# Altium project Test-Jig.PrjPcb
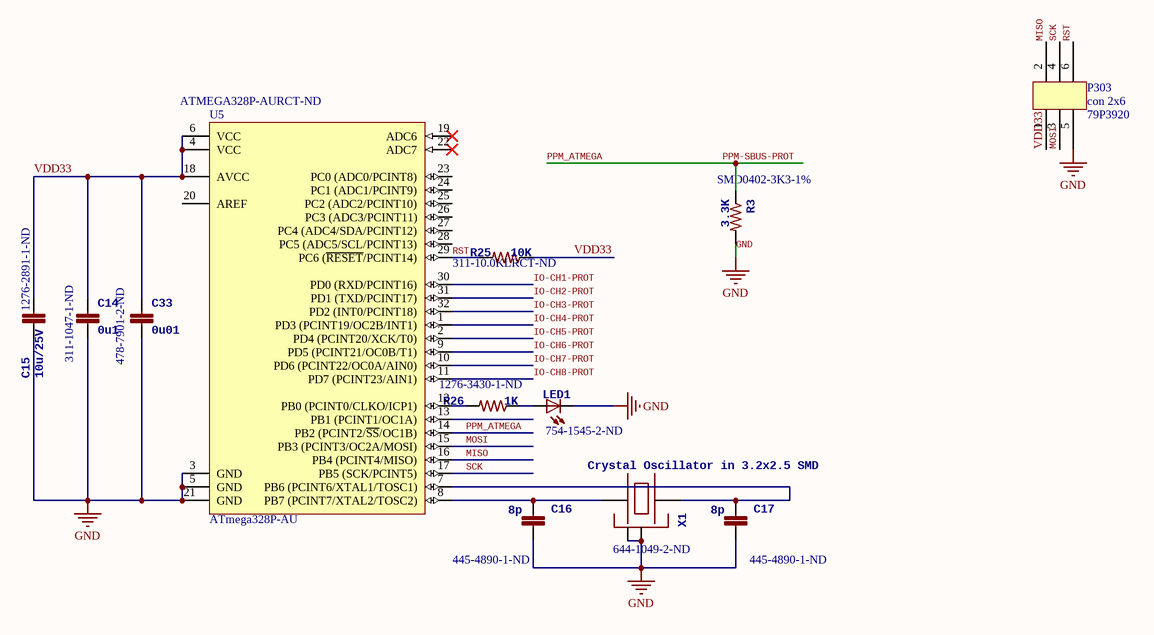
[diagram p0: Test_Jig_PPM-Encoder.SchDoc]
5 sheets, 143 parts. Net scope: global (net labels, ports and power ports of the same name join across sheets).
Board file: Test_Jig.PcbDoc
Sheets:
  Test_Jig_PPM-Encoder.SchDoc
  Test_Jig_BMP2.SchDoc
  Test_Jig_Pixhawk_DUT.SchDoc
  Test_Jig_USB.SchDoc
  Test_Jig_BMP1.SchDoc

## Sheet Test_Jig_PPM-Encoder.SchDoc
size A2; DrawnBy: Philip Rowse

### Parts
C14  0u1  Supplier Part Number 1: 311-1047-1-ND  [0402-CAP]
C15  10u/25V  Supplier Part Number 1: 1276-2891-1-ND  [0805-CAP]
C16  8p  Supplier Part Number 1: 445-4890-1-ND  [0402-CAP]
C17  8p  Supplier Part Number 1: 445-4890-1-ND  [0402-CAP]
C33  0u01  Supplier Part Number 1: 478-7901-2-ND  [0603-CAP]
LED1  Supplier Part Number 1: 754-1545-2-ND  [0603-LED-Blue]  (hidden comment: LED0603_Green)
P303  con 2x6  Supplier Part Number 1: 79P3920  [TSW-103-07-G-D]
R3  3.3K  Supplier Part Number 1: SMD0402-3K3-1%  [C0402]
R25  10K  Supplier Part Number 1: 311-10.0KLRCT-ND  [0402-RES]
R26  1K  Supplier Part Number 1: 1276-3430-1-ND  [0402-RES]
U5  ATmega328P-AU  Supplier Part Number 1: ATMEGA328P-AURCT-ND  [32A_N]
X1  Crystal Oscillator in 3.2x2.5 SMD  Supplier Part Number 1: 644-1049-2-ND  [OSCILLATOR-3.2X2.5]

### Nets
GND: C14.P$2 C15.P$2 C16.P$1 C17.P$1 C33.P$2 LED1.C P303.5 R3.2 U5.3(GND) U5.5(GND) U5.21(GND) X1.2(NC_2) X1.4(NC_4)
IO-CH1-PROT: U5.30(PD0_(RXD/PCINT16))
IO-CH2-PROT: U5.31(PD1_(TXD/PCINT17))
IO-CH3-PROT: U5.32(PD2_(INT0/PCINT18))
IO-CH4-PROT: U5.1(PD3_(PCINT19/OC2B/INT1))
IO-CH5-PROT: U5.2(PD4_(PCINT20/XCK/T0))
IO-CH6-PROT: U5.9(PD5_(PCINT21/OC0B/T1))
IO-CH7-PROT: U5.10(PD6_(PCINT22/OC0A/AIN0))
IO-CH8-PROT: U5.11(PD7_(PCINT23/AIN1))
MISO: P303.2 U5.16(PB4_(PCINT4/MISO))
MOSI: P303.3 U5.15(PB3_(PCINT3/OC2A/MOSI))
PPM-SBUS-PROT: R3.1 U5.14(PB2_(PCINT2/~{SS}/OC1B))  [also labelled PPM_ATMEGA]
RST: P303.6 R25.P$2 U5.29(PC6_(~{RESET}/PCINT14))
SCK: P303.4 U5.17(PB5_(SCK/PCINT5))
VDD33: C14.P$1 C15.P$1 C33.P$1 P303.1 R25.P$1 U5.4(VCC) U5.6(VCC) U5.18(AVCC)
NetC16_P$2: C16.P$2 U5.8(PB7_(PCINT7/XTAL2/TOSC2)) X1.1
NetC17_P$2: C17.P$2 U5.7(PB6_(PCINT6/XTAL1/TOSC1)) X1.3
NetLED1_A: LED1.A R26.P$1
NetR26_P$2: R26.P$2 U5.12(PB0_(PCINT0/CLKO/ICP1))

Not connected (* = marked no-connect by the designer): U5 13(PB1_(PCINT1/OC1A)) 19(ADC6)* 20(AREF) 22(ADC7)* 23(PC0_(ADC0/PCINT8)) 24(PC1_(ADC1/PCINT9)) 25(PC2_(ADC2/PCINT10)) 26(PC3_(ADC3/PCINT11)) 27(PC4_(ADC4/SDA/PCINT12)) 28(PC5_(ADC5/SCL/PCINT13))

### Notes on the sheet
- Title
- Size:
- Date:
- File:
- A2
- Number:
- Time:
- Revision:
- Sheet
- of

### Library data of the parts
C14 = CAP0402: CAP CER 0.1UF 16V Y5V 0402; PARTNO: CC0402ZRY5V7BB104; 3DR_PARTNO: ECM0700; Supplier 1: Digi-Key; Value: 0u1
C15 = CAP0805: CAP CER 10UF 25V 10% X5R 0805; PARTNO: CL21A106KAYNNNE; 3DR_PARTNO: ECM0714; Value: 10u/25; Supplier 1: Digi-Key
C16 C17 = CAP0402: CAP CER 8PF 50V C0G 0402; PARTNO: C1005C0G1H080C; 3DR_PARTNO: ECM0710; Supplier 1: Digi-Key; Value: 8p
C33 = CAP0603: CAP CER 10000PF 25V 5% X7R 0603; PARTNO: 06033C103JAT2A; 3DR_PARTNO: ECM0620; Supplier 1: Digi-Key; Value: 0u01
LED1 = LED0603_Blue: LED GREEN ROUND CLEAR SMD; 3DR_PARTNO: ECM0494; PARTNO: APTD1608CGCK; Supplier 1: Digi-Key; Value: GREEN
P303 = con 2x6: Connector, Header, 6Pos, 2.54MM, Vert, THT, Au; 3DR_PARTNO: PRT0445; Supplier 1: Newark
R3 = RESISTOR0402: Supplier 1: TME
R25 = RESISTOR0402-RES: RES 10K OHM 1/16W 1% 0402 SMD; PARTNO: RC0402FR-0710KL; 3DR_PARTNO: ECM0800; Supplier 1: Digi-Key; Value: 10K
R26 = RESISTOR0402-RES: RES 1K OHM 1/16W 1% 0402; PARTNO: RC1005F102CS; 3DR_PARTNO: ECM0804; Supplier 1: Digi-Key; Value: 1K
U5 = ATmega328P-AU: 8-bit AVR Microcontroller, 32KB Flash, 1KB EEPROM, 2KB SRAM, 32-pin TQFP, Industrial Grade (-40°C to 85°C); DatasheetVersion: revD, May-2011; PackageVersion: revC, Oct-2010; PackageReference: 32A; PackageDescription: 32-Lead, 7x7x1.0 mm Body, 0.8mm Lead Pitch, Thin Profile Plastic Quad Flat Package (TQFP); Code_JEDEC: MS-026-ABA; ComponentLink1Description: Manufacturer URL; ComponentLink1URL: http://www.atmel.com/; ComponentLink2Description: ATmega48A/48PA/88A/88PA/168A/168PA/328/328P Datasheet; ComponentLink2URL: http://www.atmel.com/dyn/resources/prod_documents/doc8271.pdf; ComponentLink3Description: ATmega48A/48PA/88A/88PA/168A/168PA/328/328P Summary; ComponentLink3URL: http://www.atmel.com/dyn/resources/prod_documents/8271S.pdf; Supplier 1: Digi-Key
X1 = OSCILLATOR-3.2X2.5: CRYSTAL 16MHZ 8PF SMD; PARTNO: NX3225SA-16.000MHZ-STD-CSR-1; Supplier 1: Digi-Key; Value: 16MHz

## Sheet Test_Jig_BMP2.SchDoc
size A4; DrawnBy: Philip Rowse; CHECK: SAM K; CHECK_DATE: 1/2015; DOC_TITLE_1: MAGIA NEGRA PROBE V2.0; ENGR: JEFF W; ENG_DATE: 1/2015; MFG: JUAN V; MFG_DATE: 1/2015; QA: ALLAN G; QA_DATE: 1/2015; REV: X1; YEAR: 2015
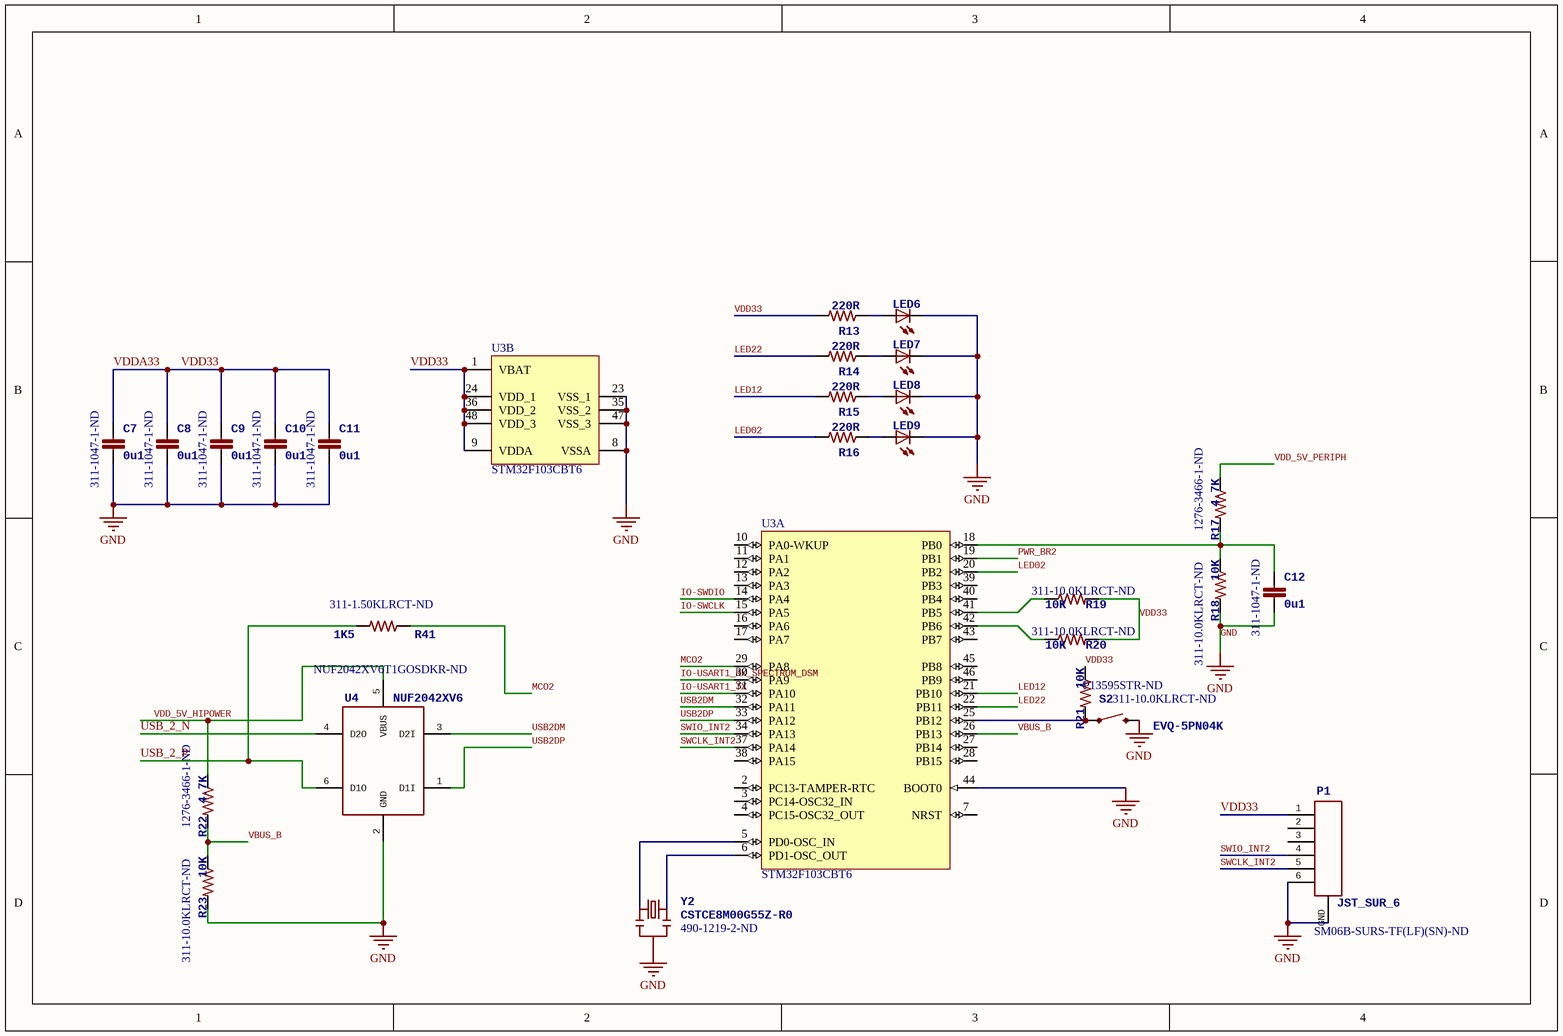
[diagram p1: Test_Jig_BMP2.SchDoc]

### Parts
C7  0u1  Supplier Part Number 1: 311-1047-1-ND  [0402-CAP]
C8  0u1  Supplier Part Number 1: 311-1047-1-ND  [0402-CAP]
C9  0u1  Supplier Part Number 1: 311-1047-1-ND  [0402-CAP]
C10  0u1  Supplier Part Number 1: 311-1047-1-ND  [0402-CAP]
C11  0u1  Supplier Part Number 1: 311-1047-1-ND  [0402-CAP]
C12  0u1  Supplier Part Number 1: 311-1047-1-ND  [0402-CAP]
LED6  LED0603_Green  [0603-LED-Blue]  (value not drawn)
LED7  LED0603_Green  [0603-LED-Blue]  (value not drawn)
LED8  LED0603_Green  [0603-LED-Blue]  (value not drawn)
LED9  LED0603_Green  [0603-LED-Blue]  (value not drawn)
P1  JST_SUR_6  Supplier Part Number 1: SM06B-SURS-TF(LF)(SN)-ND  [JST_SUR_H6]
R13  220R  [0402-RES]
R14  220R  [0402-RES]
R15  220R  [0402-RES]
R16  220R  [0402-RES]
R17  4.7K  Supplier Part Number 1: 1276-3466-1-ND  [0402-RES]
R18  10K  Supplier Part Number 1: 311-10.0KLRCT-ND  [0402-RES]
R19  10K  Supplier Part Number 1: 311-10.0KLRCT-ND  [0402-RES]
R20  10K  Supplier Part Number 1: 311-10.0KLRCT-ND  [0402-RES]
R21  10K  Supplier Part Number 1: 311-10.0KLRCT-ND  [0402-RES]
R22  4.7K  Supplier Part Number 1: 1276-3466-1-ND  [0402-RES]
R23  10K  Supplier Part Number 1: 311-10.0KLRCT-ND  [0402-RES]
R41  1K5  Supplier Part Number 1: 311-1.50KLRCT-ND  [0402-RES]
S2  EVQ-5PN04K  Supplier Part Number 1: P13595STR-ND  [TACTILE-SWITCH-1101NE]
U3  STM32F103CBT6  [STM-LQFP48_N]  (parts A,B of 2)
U4  NUF2042XV6  Supplier Part Number 1: NUF2042XV6T1GOSDKR-ND  [SOT563-6]
Y2  CSTCE8M00G55Z-R0  Supplier Part Number 1: 490-1219-2-ND  [RESONATOR-SMD]

### Nets
GND: C7.P$2 C8.P$2 C9.P$2 C10.P$2 C11.P$2 C12.P$2 LED6.C LED7.C LED8.C LED9.C P1.6 P1.GND R18.P$2 R23.P$2 S2.2 U3.8(VSSA) U3.23(VSS_1) U3.35(VSS_2) U3.44(BOOT0) U3.47(VSS_3) U4.2(GND) Y2.2
IO-SWCLK: U3.15(PA5)
IO-SWDIO: U3.14(PA4)
IO-USART1_RX_SPECTRUM_DSM: U3.30(PA9)
IO-USART1_TX: U3.31(PA10)
LED02: R16.P$2 U3.20(PB2)
LED12: R15.P$2 U3.21(PB10)
LED22: R14.P$2 U3.22(PB11)
MCO2: R41.P$1 U3.29(PA8)
PWR_BR2: U3.19(PB1)
SWCLK_INT2: P1.5 U3.37(PA14)
SWIO_INT2: P1.4 U3.34(PA13)
USB2DM: U3.32(PA11) U4.3(D2I)
USB2DP: U3.33(PA12) U4.1(D1I)
USB_2_N: U4.4(D2O)
USB_2_P: R41.P$2 U4.6(D1O)
VBUS_B: R22.P$2 R23.P$1 U3.26(PB13)
VDD33: C7.P$1 C8.P$1 C9.P$1 C10.P$1 C11.P$1 P1.1 R13.P$2 R19.P$2 R20.P$2 R21.P$1 U3.1(VBAT) U3.9(VDDA) U3.24(VDD_1) U3.36(VDD_2) U3.48(VDD_3)  [also labelled VDDA33]
VDD_5V_HIPOWER: R22.P$1 U4.5(VBUS)
VDD_5V_PERIPH: R17.P$1
NetC12_P$1: C12.P$1 R17.P$2 R18.P$1 U3.18(PB0)
NetLED6_A: LED6.A R13.P$1
NetLED7_A: LED7.A R14.P$1
NetLED8_A: LED8.A R15.P$1
NetLED9_A: LED9.A R16.P$1
NetR19_P$1: R19.P$1 U3.41(PB5)
NetR20_P$1: R20.P$1 U3.42(PB6)
NetR21_P$2: R21.P$2 S2.1 U3.25(PB12)
NetU3_5: U3.5(PD0-OSC_IN) Y2.1
NetU3_6: U3.6(PD1-OSC_OUT) Y2.3

Not connected (* = marked no-connect by the designer): P1 2 3; U3 2(PC13-TAMPER-RTC) 3(PC14-OSC32_IN) 4(PC15-OSC32_OUT) 7(NRST) 10(PA0-WKUP) 11(PA1) 12(PA2) 13(PA3) 16(PA6) 17(PA7) 27(PB14) 28(PB15) 38(PA15) 39(PB3) 40(PB4) 43(PB7) 45(PB8) 46(PB9)

### Library data of the parts
C7-C12 = CAP0402: as C14 on sheet Test_Jig_PPM-Encoder; Supplier 1: Digi-Key; Value: 0u1
LED6-LED9 = LED0603_Blue: as LED1 on sheet Test_Jig_PPM-Encoder; Supplier 1: Digi-Key; Supplier Part Number 1: 754-1545-2-ND; Value: GREEN
P1 = JST_SUR_6: Connector, Header, 6Pos, .8mm IDC, R/A, SMD, Tin; 3DR_PARTNO: PRT0442; Supplier 1: Digi-Key
R13-R16 = RESISTOR0402-RES: RES 220 OHM 1/16W 1% 0402 SMD; PARTNO: RC0402FR-07220RL; 3DR_PARTNO: ECM0821; Supplier 1: Digi-Key; Supplier Part Number 1: 311-220LRCT-ND; Value: 220R
R17 R22 = RESISTOR0402-RES: RES 10K OHM 1/16W 1% 0402 SMD; PARTNO: RC1005F472CS; Value: 10K; Supplier 1: Digi-Key
R18-R21 R23 = RESISTOR0402-RES: as R25 on sheet Test_Jig_PPM-Encoder; Supplier 1: Digi-Key; Value: 10K
R41 = RESISTOR0402-RES: RES 1.5K OHM 1/16W 1% 0402 SMD; PARTNO: RC0402FR-071K5L; 3DR_PARTNO: ECM0803; Supplier 1: Digi-Key; Value: 1K5
S2 = SWITCH-MOMENTARY-2-SMD-1101NE: Supplier 1: Digi-Key
U3 = STM32F103CBT6: ARM Cortex-M3 32-bit MCU, 128 KB Flash, 20 KB Internal RAM, 37 I/Os, 48-pin LQFP, -40 to 85 degC, Tray; A/D Converter: 2x12-bit (10 Channel); FLASH Size (Prog) (kB): 128; I/Os (High Current): 37; Internal RAM Size (kB): 20; Operating Frequency(F) (Processor speed) (MHz): 72; Supply Voltage(Vcc) min (V): 2; DatasheetVersion: Rev. 16; PackageVersion: Rev. 6, 06/2013; PackageReference: LQFP48; PackageDescription: 48-Pin Low Profile Quad Flat Package, 7 x 7 mm Body, 0.5 mm Pitch; Supplier 1: Digi-Key; Supplier Part Number 1: 497-6288-ND; Supplier 2: Farnell; Supplier Part Number 2: 1606327; Supplier 3: Newark; Supplier Part Number 3: 11N8296; Supplier 4: Newark; Supplier Part Number 4: 57P1214; Supplier 5: Mouser; Supplier Part Number 5: 511-STM32F103CBT6; Core: ARM Cortex-M3; Packing: Tray; Mounting Technology: Surface Mount; PartNumber: STM32F103CBT6; ComponentLink1Description: Manufacturer URL; ComponentLink1URL: http://www.st.com/web/en/home.html; ComponentLink2Description: Datasheet; ComponentLink2URL: http://www.st.com/st-web-ui/static/active/en/resource/technical/document/datasheet/CD00161566.pdf; ComponentLink3Description: Package Specification; ComponentLink3URL: http://www.st.com/st-web-ui/static/active/en/resource/technical/document/datasheet/DM00058181.pdf
U4 = NUF2042XV6: IC FILTER USB ESD PROTECT SOT363; PARTNO: NUF2042XV6T1G; 3DR_PARTNO: ECM0836; Supplier 1: Digi-Key
Y2 = RESONATORSMD: Supplier 1: Digi-Key

## Sheet Test_Jig_Pixhawk_DUT.SchDoc
size A2; DrawnBy: Philip Rowse
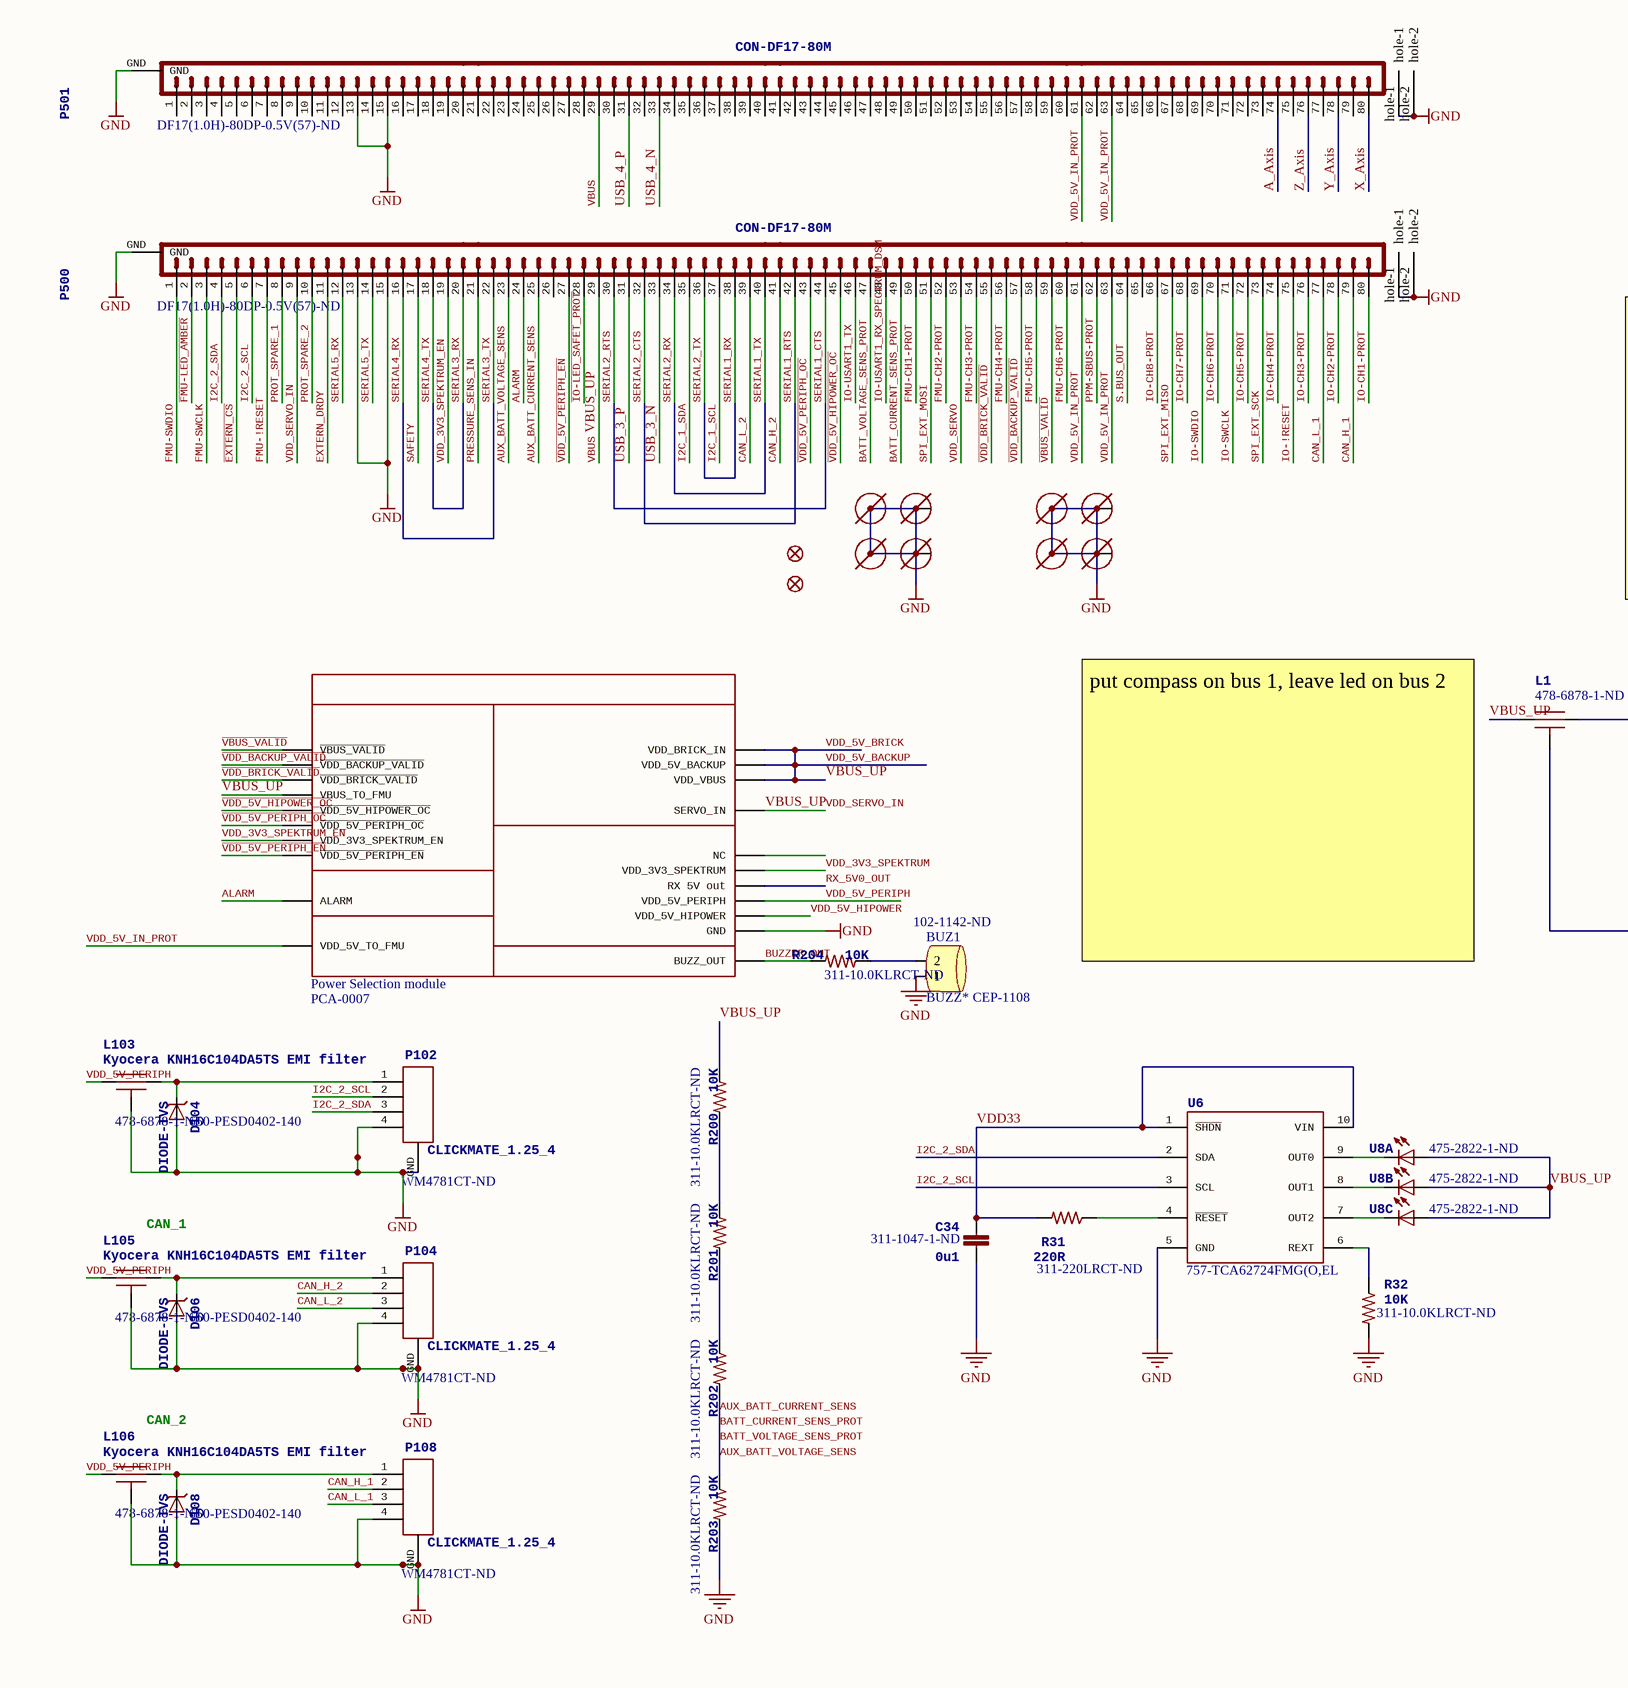
[diagram p2: Test_Jig_Pixhawk_DUT.SchDoc, left]
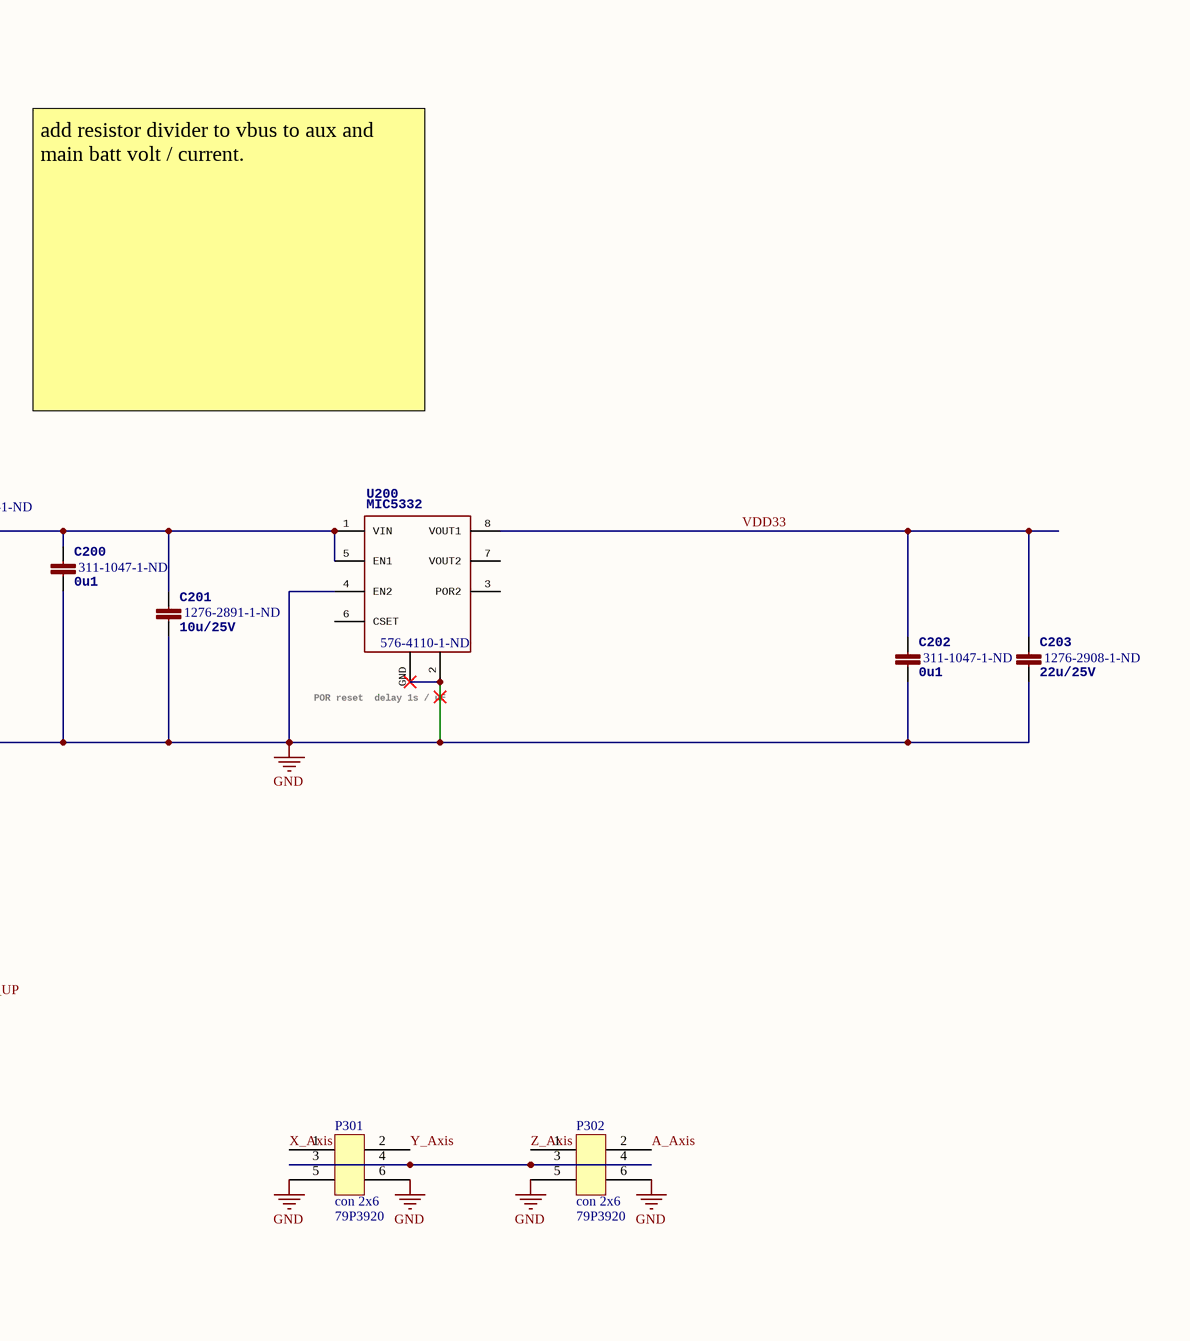
[diagram p3: Test_Jig_Pixhawk_DUT.SchDoc, right]

### Parts
BUZ1  BUZZ* CEP-1108  Supplier Part Number 1: 102-1142-ND  [CEP-1108]
C34  0u1  Supplier Part Number 1: 311-1047-1-ND  [0402-CAP]
C200  0u1  Supplier Part Number 1: 311-1047-1-ND  [0402-CAP]
C201  10u/25V  Supplier Part Number 1: 1276-2891-1-ND  [0805-CAP]
C202  0u1  Supplier Part Number 1: 311-1047-1-ND  [0402-CAP]
C203  22u/25V  Supplier Part Number 1: 1276-2908-1-ND  [0805-CAP]
D104  DIODE-TVS  Supplier Part Number 1: 650-PESD0402-140  [0402-TVS]
D106  DIODE-TVS  Supplier Part Number 1: 650-PESD0402-140  [0402-TVS]
D108  DIODE-TVS  Supplier Part Number 1: 650-PESD0402-140  [0402-TVS]
JP400  FIDUCIAL1.5X3  [FIDUCIAL-1.5X3]  (value not drawn)
JP401  FIDUCIAL1.5X3  [FIDUCIAL-1.5X3]  (value not drawn)
L1  Supplier Part Number 1: 478-6878-1-ND  [KYOCERA-KNH16-DA]  (hidden comment: Kyocera KNH16C104DA5TS EMI filter)
L103  Kyocera KNH16C104DA5TS EMI filter  Supplier Part Number 1: 478-6878-1-ND  [KYOCERA-KNH16-DA]
L105  Kyocera KNH16C104DA5TS EMI filter  Supplier Part Number 1: 478-6878-1-ND  [KYOCERA-KNH16-DA]
L106  Kyocera KNH16C104DA5TS EMI filter  Supplier Part Number 1: 478-6878-1-ND  [KYOCERA-KNH16-DA]
M3_MOUNT901  MOUNT-HOLE1.8MM  [MOUNT-HOLE1.8]  (value not drawn)
M3_MOUNT902  MOUNT-HOLE1.8MM  [MOUNT-HOLE1.8]  (value not drawn)
M3_MOUNT903  MOUNT-HOLE1.8MM  [MOUNT-HOLE1.8]  (value not drawn)
M3_MOUNT904  MOUNT-HOLE1.8MM  [MOUNT-HOLE1.8]  (value not drawn)
M3_MOUNT911  MOUNT-HOLE1.8MM  [MOUNT-HOLE1.8]  (value not drawn)
M3_MOUNT912  MOUNT-HOLE1.8MM  [MOUNT-HOLE1.8]  (value not drawn)
M3_MOUNT913  MOUNT-HOLE1.8MM  [MOUNT-HOLE1.8]  (value not drawn)
M3_MOUNT914  MOUNT-HOLE1.8MM  [MOUNT-HOLE1.8]  (value not drawn)
P102  CLICKMATE_1.25_4  Supplier Part Number 1: WM4781CT-ND  [CLICKMATE_V4]
P104  CLICKMATE_1.25_4  Supplier Part Number 1: WM4781CT-ND  [CLICKMATE_V4]
P108  CLICKMATE_1.25_4  Supplier Part Number 1: WM4781CT-ND  [CLICKMATE_V4]
P301  con 2x6  Supplier Part Number 1: 79P3920  [TSW-103-07-G-D]
P302  con 2x6  Supplier Part Number 1: 79P3920  [TSW-103-07-G-D]
P500  CON-DF17-80M  Supplier Part Number 1: DF17(1.0H)-80DP-0.5V(57)-ND  [CON-DF17-80M]
P501  CON-DF17-80M  Supplier Part Number 1: DF17(1.0H)-80DP-0.5V(57)-ND  [CON-DF17-80M]
PSM200  Power Selection module  Supplier Part Number 1: PCA-0007  [PSM]
R31  220R  Supplier Part Number 1: 311-220LRCT-ND  [0402-RES]
R32  10K  Supplier Part Number 1: 311-10.0KLRCT-ND  [0402-RES]
R200  10K  Supplier Part Number 1: 311-10.0KLRCT-ND  [0402-RES]
R201  10K  Supplier Part Number 1: 311-10.0KLRCT-ND  [0402-RES]
R202  10K  Supplier Part Number 1: 311-10.0KLRCT-ND  [0402-RES]
R203  10K  Supplier Part Number 1: 311-10.0KLRCT-ND  [0402-RES]
R204  10K  Supplier Part Number 1: 311-10.0KLRCT-ND  [0402-RES]
U6  Supplier Part Number 1: 757-TCA62724FMG(O,EL  [SON10]  (hidden comment: TCA62724FMG)
U8  Supplier Part Number 1: 475-2822-1-ND  [6-PLCC]  (hidden comment: LRTB GFTG-T7AW-1+V7A7-29+R5T9-49-L)  (parts A,B,C of 3)
U200  MIC5332  Supplier Part Number 1: 576-4110-1-ND  [MLF-8-EPAD]

### Nets
GND: BUZ1.1 C34.P$1 C200.P$2 C201.P$2 C202.P$2 C203.P$2 D104.A D106.A D108.A L1.GND L103.GND L105.GND L106.GND M3_MOUNT901.1 M3_MOUNT902.1 M3_MOUNT903.1 M3_MOUNT904.1 M3_MOUNT911.1 M3_MOUNT912.1 M3_MOUNT913.1 M3_MOUNT914.1 P102.4 P102.GND P104.4 P104.GND P108.4 P108.GND P301.5 P301.6 P302.5 P302.6 P500.13 P500.15 P500.GND P500.hole-1 P500.hole-2 P501.13 P501.15 P501.GND P501.hole-1 P501.hole-2 PSM200.GND R32.P$2 R203.P$2 U6.5(GND) U200.2(GND) U200.4(EN2) U200.GND
A_Axis: P302.2 P501.74
ALARM: P500.24 PSM200.ALARM
AUX_BATT_CURRENT_SENS: P500.23 P500.25 P500.47 P500.49 R202.P$2 R203.P$1  [also labelled AUX_BATT_VOLTAGE_SENS, BATT_CURRENT_SENS_PROT, BATT_VOLTAGE_SENS_PROT]
BUZZER_OUT: PSM200.BUZZER_OUT(BUZZ_OUT) R204.P$2
CAN_H_1: P108.2 P500.79
CAN_H_2: P104.2 P500.41
CAN_L_1: P108.3 P500.77
CAN_L_2: P104.3 P500.39
~{EXTERN_CS}: P500.5
EXTERN_DRDY: P500.11
~{FMU-LED_AMBER}: P500.2
FMU-!RESET: P500.7
FMU-CH1-PROT: P500.50
FMU-CH2-PROT: P500.52
FMU-CH3-PROT: P500.54
FMU-CH4-PROT: P500.56
FMU-CH5-PROT: P500.58
FMU-CH6-PROT: P500.60
FMU-SWCLK: P500.3
FMU-SWDIO: P500.1
I2C_1_SCL: P500.37
I2C_1_SDA: P500.35
I2C_2_SCL: P102.2 P500.6 U6.3(SCL)
I2C_2_SDA: P102.3 P500.4 U6.2(SDA)
~{IO-LED_SAFET_PROT}: P500.28
IO-!RESET: P500.75
IO-CH1-PROT: P500.80
IO-CH2-PROT: P500.78
IO-CH3-PROT: P500.76
IO-CH4-PROT: P500.74
IO-CH5-PROT: P500.72
IO-CH6-PROT: P500.70
IO-CH7-PROT: P500.68
IO-CH8-PROT: P500.66
IO-SWCLK: P500.71
IO-SWDIO: P500.69
IO-USART1_RX_SPECTRUM_DSM: P500.48
IO-USART1_TX: P500.46
PPM-SBUS-PROT: P500.62
PRESSURE_SENS_IN: P500.21
PROT_SPARE_1: P500.8
PROT_SPARE_2: P500.10
RX_5V0_OUT: PSM200.RX(RX_5V_out)
S.BUS_OUT: P500.64
SAFETY: P500.17
SERIAL1_CTS: P500.30 P500.44  [also labelled SERIAL2_RTS]
SERIAL1_RTS: P500.32 P500.42  [also labelled SERIAL2_CTS]
SERIAL1_RX: P500.36 P500.38  [also labelled SERIAL2_TX]
SERIAL1_TX: P500.34 P500.40  [also labelled SERIAL2_RX]
SERIAL3_RX: P500.18 P500.20  [also labelled SERIAL4_TX]
SERIAL3_TX: P500.16 P500.22  [also labelled SERIAL4_RX]
SERIAL5_RX: P500.12
SERIAL5_TX: P500.14
SPI_EXT_MISO: P500.67
SPI_EXT_MOSI: P500.51
SPI_EXT_SCK: P500.73
USB_3_N: P500.33
USB_3_P: P500.31
USB_4_N: P501.33
USB_4_P: P501.31
~{VBUS_VALID}: P500.59 PSM200.!VBUS_VALID(~{VBUS_VALID})
~{VDD_5V_HIPOWER_OC}: P500.45 PSM200.!VDD_5V_HIPOWER_OC(~{VDD_5V_HIPOWER_OC})
~{VDD_5V_PERIPH_EN}: P500.27 PSM200.!VDD_5V_PERIPH_EN(~{VDD_5V_PERIPH_EN})
~{VDD_5V_PERIPH_OC}: P500.43 PSM200.!VDD_5V_PERIPH_OC(~{VDD_5V_PERIPH_OC})
~{VDD_BACKUP_VALID}: P500.57 PSM200.!VDD_BACKUP_VALID(~{VDD_BACKUP_VALID})
~{VDD_BRICK_VALID}: P500.55 PSM200.!VDD_BRICK_VALID(~{VDD_BRICK_VALID})
VBUS: L1.P$1 P500.9 P500.29 P501.29 PSM200.SERVO_IN PSM200.VBUS(VBUS_TO_FMU) PSM200.VDD_5V_BACKUP PSM200.VDD_BRICK_IN PSM200.VDD_VBUS R200.P$1 U8.A1(A) U8.A2(A) U8.A3(A)  [also labelled VBUS_UP, VDD_5V_BACKUP, VDD_5V_BRICK, VDD_SERVO_IN]
VDD33: C34.P$2 C202.P$1 C203.P$1 R31.P$2 U6.1(~{SHDN}) U6.10(VIN) U200.8(VOUT1)
VDD_3V3_SPEKTRUM: PSM200.SPEK(VDD_3V3_SPEKTRUM)
VDD_3V3_SPEKTRUM_EN: P500.19 PSM200.VDD_3V3_SPEKTRUM_EN
VDD_5V_HIPOWER: PSM200.5V_HIPOWER(VDD_5V_HIPOWER)
VDD_5V_IN_PROT: P500.61 P500.63 P501.61 P501.63 PSM200.VDD_5V_IN_PROT(VDD_5V_TO_FMU)
VDD_5V_PERIPH: L103.P$1 L105.P$1 L106.P$1 PSM200.5V_PERIPH(VDD_5V_PERIPH)
VDD_SERVO: P500.53
X_Axis: P301.1 P501.80
Y_Axis: P301.2 P501.78
Z_Axis: P302.1 P501.76
NetBUZ1_2: BUZ1.2 R204.P$1
NetC200_P$1: C200.P$1 C201.P$1 L1.P$2 U200.1(VIN) U200.5(EN1)
NetD104_C: D104.C L103.P$2 P102.1
NetD106_C: D106.C L105.P$2 P104.1
NetD108_C: D108.C L106.P$2 P108.1
NetP301_3: P301.3 P301.4 P302.3 P302.4
NetR31_P$1: R31.P$1 U6.4(~{RESET})
NetR32_P$1: R32.P$1 U6.6(REXT)
NetR200_P$2: R200.P$2 R201.P$1
NetR201_P$2: R201.P$2 R202.P$1
NetU6_7: U6.7(OUT2) U8.C3(C)
NetU6_8: U6.8(OUT1) U8.C2(C)
NetU6_9: U6.9(OUT0) U8.C1(C)

Not connected (* = marked no-connect by the designer): P500 26 65; P501 1 2 3 4 5 6 7 8 9 10 11 12 14 16 17 18 19 20 21 22 23 24 25 26 27 28 30 32 34 35 36 37 38 39 40 41 42 43 44 45 46 47 48 49 50 51 52 53 54 55 56 57 58 59 60 62 64 65 66 67 68 69 70 71 72 73 75 77 79; PSM200 NC; U200 3(POR2) 6(CSET) 7(VOUT2)

### Notes on the sheet
- add resistor divider to vbus to aux and main batt volt / current.
- (near U200) POR reset
  delay 1s / uF
- put compass on bus 1, leave led on bus 2
- (near L105) CAN_1
- (near L106) CAN_2
- Title
- Size:
- Date:
- File:
- A2
- Number:
- Time:
- Revision:
- Sheet
- of

### Library data of the parts
BUZ1 = BUZZ* CEP-1108: Manufacturer: CUI; Digikey: 102-1142-ND; P/N: CEP-1108; Supplier 1: Digi-Key
C34 = CAP0402: PARTNO: CC0402ZRY5V7BB104; Supplier 1: Digi-Key
C200 C202 = CAP0402: Supplier 1: Digi-Key
C201 C203 = CAP0805: Supplier 1: Digi-Key
D104 D106 D108 = DIODE-TVS: Diode, TVS, 14VWM, 40VC, 0402, SMD; 3DR_PARTNO: ECM0837; Supplier 1: Mouser
JP400 JP401 = FIDUCIAL1.5X3: <b>Fiducial Alignment Points</b> / Various fiducial points for machine vision alignment.; BOM: EXCLUDE; PARTNO: *
L1 = KNH16C104DA5TS: Supplier 1: Digi-Key
L103 L105 L106 = KNH16C104DA5TS: Capacitor, Filter, 0.1uF, 25V, 2A, 0603, SMD; 3DR_PARTNO: ECM0719; Supplier 1: Digi-Key
P102 P104 P108 = CLICKMATE_1.25_4: Connector, Rcpt, 4Pos, 1.25MM, W/B, VERT, SMD, Tin; 3DR_PARTNO: PRT0441; Supplier 1: Digi-Key
P301 P302 = con 2x6: as P303 on sheet Test_Jig_PPM-Encoder; Supplier 1: Newark
P500 P501 = CON-DF17-80M: Connector, Header, 80Pos, .5MM, DUAL, SMD, Au; 3DR_PARTNO: PRT0436; Supplier 1: Digi-Key
PSM200 = PSMPSM: PCA, PSM, PX4, Assembly; Manufacturer 1: 3DR; Mfg Part Num (Alternate): DO NOT SWAP; 3DR_PARTNO: PCA0007; Supplier 1: 3DR; Supplier Unit Price 1: 17; Manufacturer Part Number 1: PCA-0007; Supplier Currency 1: USD; Supplier Order Qty 1: 100
R31 = RESISTOR0402-RES: Supplier 1: Digi-Key
R32 = RESISTOR0402-RES: PARTNO: RC0402FR-0710KL; Supplier 1: Digi-Key
R200-R204 = RESISTOR0402-RES: as R25 on sheet Test_Jig_PPM-Encoder; Supplier 1: Digi-Key; Value: 10K
U6 = TCA62724FMG: Toshiba TCA62724FMG I2C RGB LED driver; Supplier 1: Mouser
U8 = RGB-LED6-PLCC: RGB LED with separate anode/cathode terminals; Supplier 1: Digi-Key
U200 = MIC5332: Supplier 1: Digi-Key

## Sheet Test_Jig_USB.SchDoc
size A4; DrawnBy: Philip Rowse
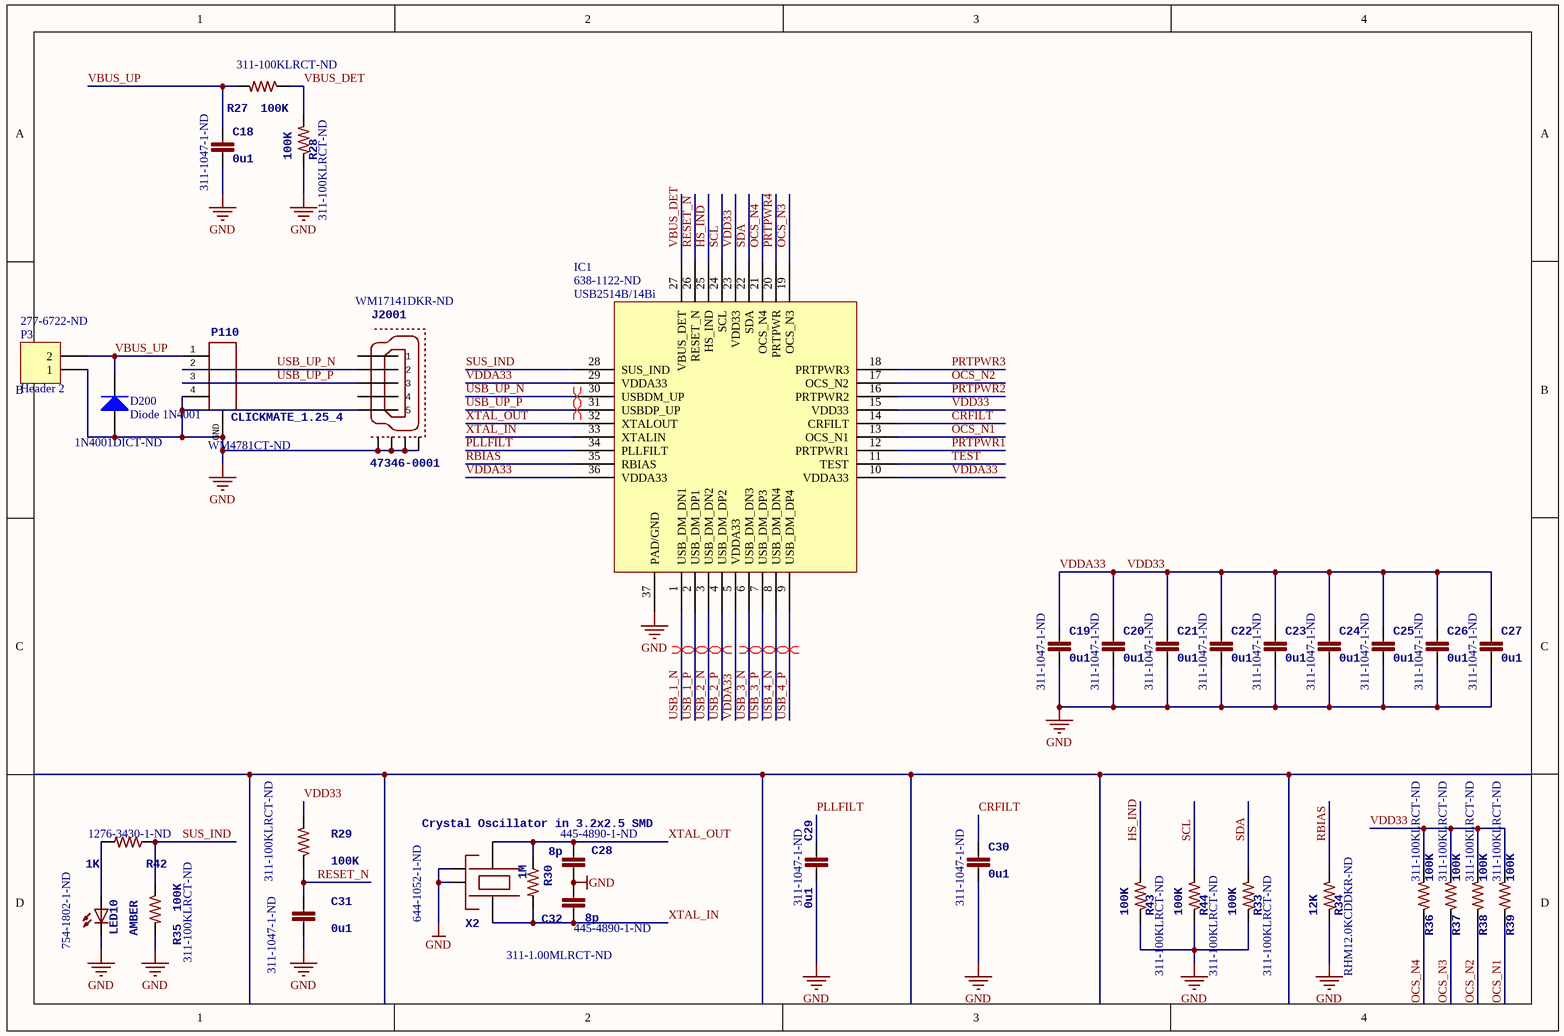
[diagram p4: Test_Jig_USB.SchDoc]

### Parts
C18  0u1  Supplier Part Number 1: 311-1047-1-ND  [0402-CAP]
C19  0u1  Supplier Part Number 1: 311-1047-1-ND  [0402-CAP]
C20  0u1  Supplier Part Number 1: 311-1047-1-ND  [0402-CAP]
C21  0u1  Supplier Part Number 1: 311-1047-1-ND  [0402-CAP]
C22  0u1  Supplier Part Number 1: 311-1047-1-ND  [0402-CAP]
C23  0u1  Supplier Part Number 1: 311-1047-1-ND  [0402-CAP]
C24  0u1  Supplier Part Number 1: 311-1047-1-ND  [0402-CAP]
C25  0u1  Supplier Part Number 1: 311-1047-1-ND  [0402-CAP]
C26  0u1  Supplier Part Number 1: 311-1047-1-ND  [0402-CAP]
C27  0u1  Supplier Part Number 1: 311-1047-1-ND  [0402-CAP]
C28  8p  Supplier Part Number 1: 445-4890-1-ND  [0402-CAP]
C29  0u1  Supplier Part Number 1: 311-1047-1-ND  [0402-CAP]
C30  0u1  Supplier Part Number 1: 311-1047-1-ND  [0402-CAP]
C31  0u1  Supplier Part Number 1: 311-1047-1-ND  [0402-CAP]
C32  8p  Supplier Part Number 1: 445-4890-1-ND  [0402-CAP]
D200  Diode 1N4001  Supplier Part Number 1: 1N4001DICT-ND  [DO-41]
IC1  USB2514B/14Bi  Supplier Part Number 1: 638-1122-ND  [QFN36 USB]
J2001  47346-0001  Supplier Part Number 1: WM17141DKR-ND  [MOLEX-47346-0001]
LED10  AMBER  Supplier Part Number 1: 754-1802-1-ND  [0603-LED]
P3  Header 2  Supplier Part Number 1: 277-6722-ND  [1790283]
P110  CLICKMATE_1.25_4  Supplier Part Number 1: WM4781CT-ND  [CLICKMATE_V4]
R27  100K  Supplier Part Number 1: 311-100KLRCT-ND  [0402-RES]
R28  100K  Supplier Part Number 1: 311-100KLRCT-ND  [0402-RES]
R29  100K  Supplier Part Number 1: 311-100KLRCT-ND  [0402-RES]
R30  1M  Supplier Part Number 1: 311-1.00MLRCT-ND  [0402-RES]
R33  100K  Supplier Part Number 1: 311-100KLRCT-ND  [0402-RES]
R34  12K  Supplier Part Number 1: RHM12.0KCDDKR-ND  [0402-RES]
R35  100K  Supplier Part Number 1: 311-100KLRCT-ND  [0402-RES]
R36  100K  Supplier Part Number 1: 311-100KLRCT-ND  [0402-RES]
R37  100K  Supplier Part Number 1: 311-100KLRCT-ND  [0402-RES]
R38  100K  Supplier Part Number 1: 311-100KLRCT-ND  [0402-RES]
R39  100K  Supplier Part Number 1: 311-100KLRCT-ND  [0402-RES]
R42  1K  Supplier Part Number 1: 1276-3430-1-ND  [0402-RES]
R43  100K  Supplier Part Number 1: 311-100KLRCT-ND  [0402-RES]
R44  100K  Supplier Part Number 1: 311-100KLRCT-ND  [0402-RES]
X2  Crystal Oscillator in 3.2x2.5 SMD  Supplier Part Number 1: 644-1052-1-ND  [OSCILLATOR-3.2X2.5]

### Nets
GND: C18.P$2 C19.P$2 C20.P$2 C21.P$2 C22.P$2 C23.P$2 C24.P$2 C25.P$2 C26.P$2 C27.P$2 C28.P$1 C29.P$2 C30.P$2 C31.P$2 C32.P$2 D200.1(A) IC1.37(PAD/GND) J2001.GND(5) J2001.GND1 J2001.GND2 J2001.GND3 J2001.GND4 LED10.C P3.1 P110.4 P110.GND R28.P$1 R33.P$1 R34.P$1 R35.P$2 R43.P$1 R44.P$1 X2.2(NC_2) X2.4(NC_4)
CRFILT: C30.P$1 IC1.14(CRFILT)
HS_IND: IC1.25(HS_IND) R43.P$2
OCS_N1: IC1.13(OCS_N1) R39.P$1
OCS_N2: IC1.17(OCS_N2) R38.P$1
OCS_N3: IC1.19(OCS_N3) R37.P$1
OCS_N4: IC1.21(OCS_N4) R36.P$1
PLLFILT: C29.P$1 IC1.34(PLLFILT)
PRTPWR1: IC1.12(PRTPWR1)
PRTPWR2: IC1.16(PRTPWR2)
PRTPWR3: IC1.18(PRTPWR3)
PRTPWR4: IC1.20(PRTPWR)
RBIAS: IC1.35(RBIAS) R34.P$2
RESET_N: C31.P$1 IC1.26(RESET_N) R29.P$1
SCL: IC1.24(SCL) R44.P$2
SDA: IC1.22(SDA) R33.P$2
SUS_IND: IC1.28(SUS_IND) R35.P$1 R42.P$1
TEST: IC1.11(TEST)
USB_1_N: IC1.1(USB_DM_DN1)
USB_1_P: IC1.2(USB_DM_DP1)
USB_2_N: IC1.3(USB_DM_DN2)
USB_2_P: IC1.4(USB_DM_DP2)
USB_3_N: IC1.6(USB_DM_DN3)
USB_3_P: IC1.7(USB_DM_DP3)
USB_4_N: IC1.8(USB_DM_DN4)
USB_4_P: IC1.9(USB_DM_DP4)
USB_UP_N: IC1.30(USBDM_UP) J2001.D-(2) P110.2
USB_UP_P: IC1.31(USBDP_UP) J2001.D+(3) P110.3
VBUS_DET: IC1.27(VBUS_DET) R27.P$1 R28.P$2
VBUS_UP: C18.P$1 D200.2(K) P3.2 P110.1 R27.P$2  [project net VBUS]
VDD33: C19.P$1 C20.P$1 C21.P$1 C22.P$1 C23.P$1 C24.P$1 C25.P$1 C26.P$1 C27.P$1 IC1.5(VDDA33) IC1.10(VDDA33) IC1.15(VDD33) IC1.23(VDD33) IC1.29(VDDA33) IC1.36(VDDA33) R29.P$2 R36.P$2 R37.P$2 R38.P$2 R39.P$2  [also labelled VDDA33]
XTAL_IN: C32.P$1 IC1.33(XTALIN) R30.P$2 X2.3
XTAL_OUT: C28.P$2 IC1.32(XTALOUT) R30.P$1 X2.1
NetLED10_A: LED10.A R42.P$2

Not connected (* = marked no-connect by the designer): J2001 ID(4) VBUS(1)

### Layout directives
differential pair: USB_1_N, USB_1_P, USB_2_N, USB_2_P, USB_3_N, USB_3_P, USB_4_N, USB_4_P, USB_UP_N, USB_UP_P

### Library data of the parts
C18-C27 C29-C31 = CAP0402: as C14 on sheet Test_Jig_PPM-Encoder; Supplier 1: Digi-Key; Value: 0u1
C28 C32 = CAP0402: as C16 on sheet Test_Jig_PPM-Encoder; Supplier 1: Digi-Key; Value: 8p
D200 = Diode 1N4001: 1 Amp General Purpose Rectifier; Published: 8-Jun-2000; LatestRevisionDate: 17-Jul-2002; LatestRevisionNote: Re-released for DXP Platform.; DatasheetVersion: 1998; PackageVersion: Aug-1999; PackageReference: DO-41; Publisher: Altium Limited; PackageDescription: Diode, Axial; Body 5.2 x 2.7 mm (LxDia. max), Lead Dia. 0.86 mm (max); Code_JEDEC: DO-204-AL; ComponentLink1Description: Manufacturer Link; ComponentLink1URL: http://www.fairchildsemi.com/; ComponentLink2Description: Datasheet; ComponentLink2URL: http://www.fairchildsemi.com/ds/1N%2F1N4001.pdf; Supplier 1: Digi-Key
J2001 = MOLEX-47346-0001: MICRO USB B, BOTTOM MOUNT; 3DR_PARTNO: ECM0486; PARTNO: 0473460001; Supplier 1: Digi-Key
LED10 = LED0603: LED 1.6X0.8 DOME ORN CLEAR SMD; PARTNO: APTD1608SECK; 3DR_PARTNO: ECM0515; Supplier 1: Digi-Key; Value: AMBER
P3 = Header 2: Header, 2-Pin; LatestRevisionDate: 17-Jul-2002; LatestRevisionNote: Re-released for DXP Platform.; Publisher: Altium Limited; Supplier 1: Digi-Key
P110 = CLICKMATE_1.25_4: as P102 on sheet Test_Jig_Pixhawk_DUT; Supplier 1: Digi-Key
R27-R29 R33 R35-R39 R43 R44 = RESISTOR0402-RES: RES 100K OHM 1/16W 1% 0402 SMD; 3DR_PARTNO: ECM0818; PARTNO: RC0402FR-07100KL; Supplier 1: Digi-Key; Value: 100K
R30 = RESISTOR0402-RES: RES 1M OHM 1/16W 1% 0402 SMD; PARTNO: RC0402FR-071ML; 3DR_PARTNO: ECM0806; Supplier 1: Digi-Key; Value: 1M
R34 = RESISTOR0402-RES: RES 12K OHM 1/16W 1% 0402 SMD; Value: 12K; Supplier 1: Digi-Key
R42 = RESISTOR0402-RES: as R26 on sheet Test_Jig_PPM-Encoder; Supplier 1: Digi-Key; Value: 1K
X2 = OSCILLATOR-3.2X2.5: CRYSTAL 24MHZ 8PF SMD; 3DR_PARTNO: ECM0708; PARTNO: NX3225SA-24.000MHZ-STD-CSR-1; Supplier 1: Digi-Key; Value: 24MHz
IC1 = USB2514B/14Bi: Supplier 1: Digi-Key

## Sheet Test_Jig_BMP1.SchDoc
size A4; DrawnBy: Philip Rowse
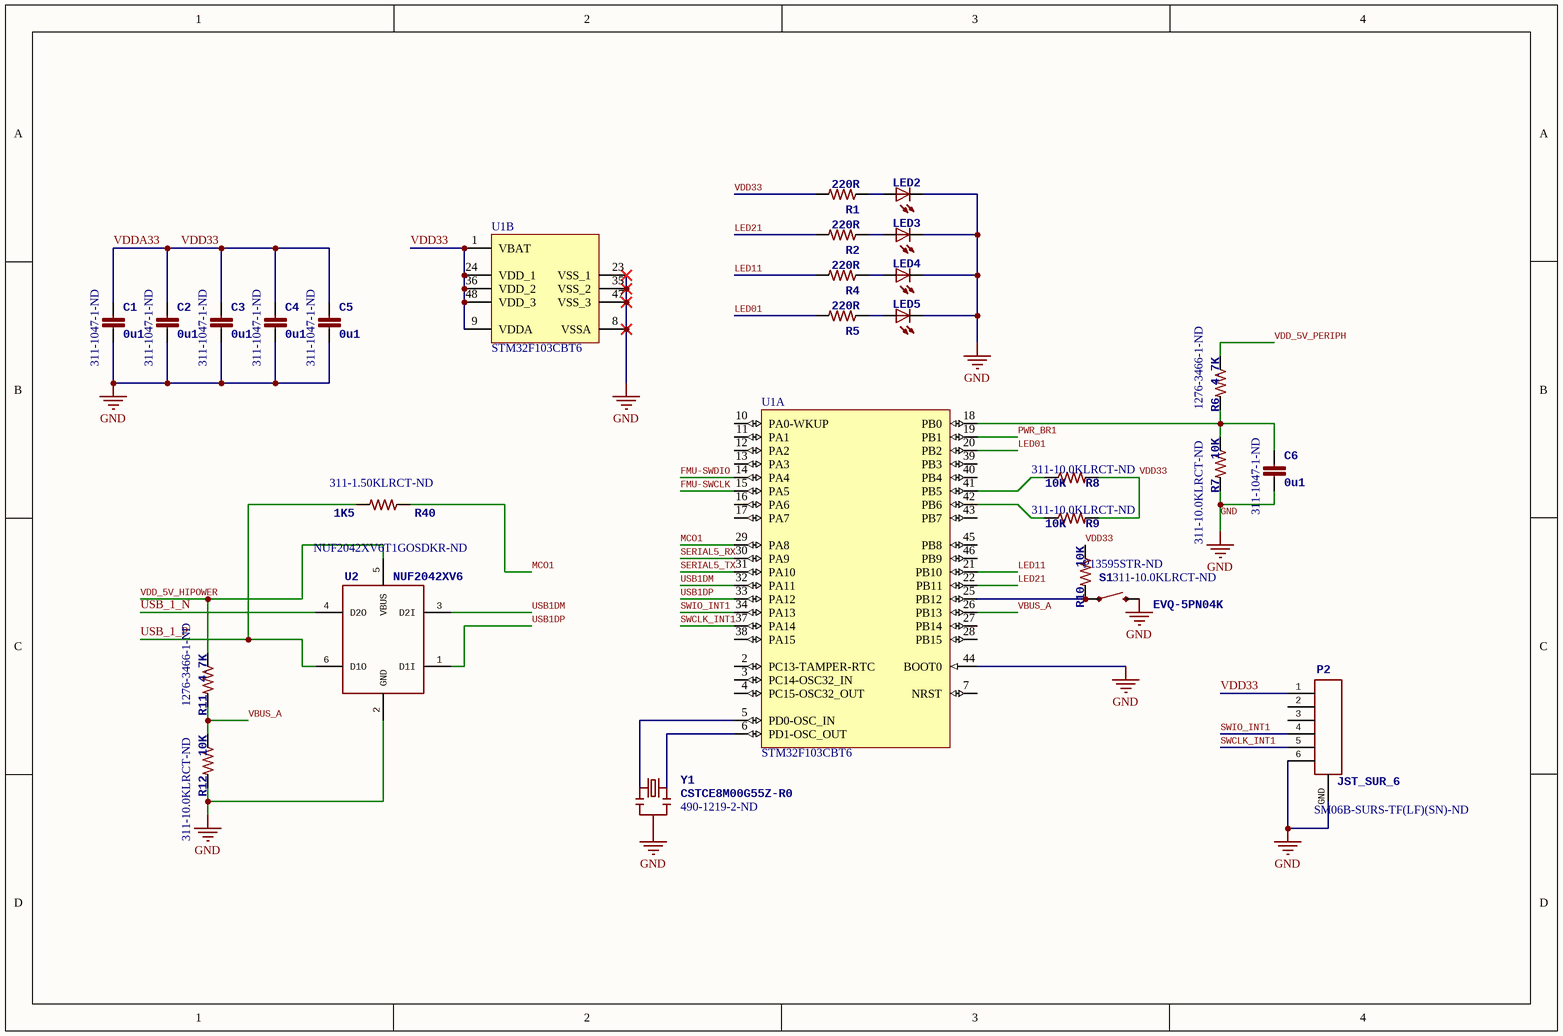
[diagram p5: Test_Jig_BMP1.SchDoc]

### Parts
C1  0u1  Supplier Part Number 1: 311-1047-1-ND  [0402-CAP]
C2  0u1  Supplier Part Number 1: 311-1047-1-ND  [0402-CAP]
C3  0u1  Supplier Part Number 1: 311-1047-1-ND  [0402-CAP]
C4  0u1  Supplier Part Number 1: 311-1047-1-ND  [0402-CAP]
C5  0u1  Supplier Part Number 1: 311-1047-1-ND  [0402-CAP]
C6  0u1  Supplier Part Number 1: 311-1047-1-ND  [0402-CAP]
LED2  LED0603_Green  [0603-LED-Blue]  (value not drawn)
LED3  LED0603_Green  [0603-LED-Blue]  (value not drawn)
LED4  LED0603_Green  [0603-LED-Blue]  (value not drawn)
LED5  LED0603_Green  [0603-LED-Blue]  (value not drawn)
P2  JST_SUR_6  Supplier Part Number 1: SM06B-SURS-TF(LF)(SN)-ND  [JST_SUR_H6]
R1  220R  [0402-RES]
R2  220R  [0402-RES]
R4  220R  [0402-RES]
R5  220R  [0402-RES]
R6  4.7K  Supplier Part Number 1: 1276-3466-1-ND  [0402-RES]
R7  10K  Supplier Part Number 1: 311-10.0KLRCT-ND  [0402-RES]
R8  10K  Supplier Part Number 1: 311-10.0KLRCT-ND  [0402-RES]
R9  10K  Supplier Part Number 1: 311-10.0KLRCT-ND  [0402-RES]
R10  10K  Supplier Part Number 1: 311-10.0KLRCT-ND  [0402-RES]
R11  4.7K  Supplier Part Number 1: 1276-3466-1-ND  [0402-RES]
R12  10K  Supplier Part Number 1: 311-10.0KLRCT-ND  [0402-RES]
R40  1K5  Supplier Part Number 1: 311-1.50KLRCT-ND  [0402-RES]
S1  EVQ-5PN04K  Supplier Part Number 1: P13595STR-ND  [TACTILE-SWITCH-1101NE]
U1  STM32F103CBT6  [STM-LQFP48_N]  (parts A,B of 2)
U2  NUF2042XV6  Supplier Part Number 1: NUF2042XV6T1GOSDKR-ND  [SOT563-6]
Y1  CSTCE8M00G55Z-R0  Supplier Part Number 1: 490-1219-2-ND  [RESONATOR-SMD]

### Nets
GND: C1.P$2 C2.P$2 C3.P$2 C4.P$2 C5.P$2 C6.P$2 LED2.C LED3.C LED4.C LED5.C P2.6 P2.GND R7.P$2 R12.P$2 S1.2 U1.8(VSSA) U1.23(VSS_1) U1.35(VSS_2) U1.44(BOOT0) U1.47(VSS_3) U2.2(GND) Y1.2
FMU-SWCLK: U1.15(PA5)
FMU-SWDIO: U1.14(PA4)
LED01: R5.P$2 U1.20(PB2)
LED11: R4.P$2 U1.21(PB10)
LED21: R2.P$2 U1.22(PB11)
MCO1: R40.P$1 U1.29(PA8)
PWR_BR1: U1.19(PB1)
SERIAL5_RX: U1.30(PA9)
SERIAL5_TX: U1.31(PA10)
SWCLK_INT1: P2.5 U1.37(PA14)
SWIO_INT1: P2.4 U1.34(PA13)
USB1DM: U1.32(PA11) U2.3(D2I)
USB1DP: U1.33(PA12) U2.1(D1I)
USB_1_N: U2.4(D2O)
USB_1_P: R40.P$2 U2.6(D1O)
VBUS_A: R11.P$2 R12.P$1 U1.26(PB13)
VDD33: C1.P$1 C2.P$1 C3.P$1 C4.P$1 C5.P$1 P2.1 R1.P$2 R8.P$2 R9.P$2 R10.P$1 U1.1(VBAT) U1.9(VDDA) U1.24(VDD_1) U1.36(VDD_2) U1.48(VDD_3)  [also labelled VDDA33]
VDD_5V_HIPOWER: R11.P$1 U2.5(VBUS)
VDD_5V_PERIPH: R6.P$1
NetC6_P$1: C6.P$1 R6.P$2 R7.P$1 U1.18(PB0)
NetLED2_A: LED2.A R1.P$1
NetLED3_A: LED3.A R2.P$1
NetLED4_A: LED4.A R4.P$1
NetLED5_A: LED5.A R5.P$1
NetR8_P$1: R8.P$1 U1.41(PB5)
NetR9_P$1: R9.P$1 U1.42(PB6)
NetR10_P$2: R10.P$2 S1.1 U1.25(PB12)
NetU1_5: U1.5(PD0-OSC_IN) Y1.1
NetU1_6: U1.6(PD1-OSC_OUT) Y1.3

Not connected (* = marked no-connect by the designer): P2 2 3; U1 2(PC13-TAMPER-RTC) 3(PC14-OSC32_IN) 4(PC15-OSC32_OUT) 7(NRST) 10(PA0-WKUP) 11(PA1) 12(PA2) 13(PA3) 16(PA6) 17(PA7) 27(PB14) 28(PB15) 38(PA15) 39(PB3) 40(PB4) 43(PB7) 45(PB8) 46(PB9)

### Library data of the parts
C1-C6 = CAP0402: as C14 on sheet Test_Jig_PPM-Encoder; Supplier 1: Digi-Key; Value: 0u1
LED2-LED5 = LED0603_Blue: as LED1 on sheet Test_Jig_PPM-Encoder; Supplier 1: Digi-Key; Supplier Part Number 1: 754-1545-2-ND; Value: GREEN
P2 = JST_SUR_6: as P1 on sheet Test_Jig_BMP2; Supplier 1: Digi-Key
R1 R2 R4 R5 = RESISTOR0402-RES: as R13 on sheet Test_Jig_BMP2; Supplier 1: Digi-Key; Supplier Part Number 1: 311-220LRCT-ND; Value: 220R
R6 R11 = RESISTOR0402-RES: as R17 on sheet Test_Jig_BMP2; Value: 10K; Supplier 1: Digi-Key
R7-R10 R12 = RESISTOR0402-RES: as R25 on sheet Test_Jig_PPM-Encoder; Supplier 1: Digi-Key; Value: 10K
R40 = RESISTOR0402-RES: as R41 on sheet Test_Jig_BMP2; Supplier 1: Digi-Key; Value: 1K5
S1 = SWITCH-MOMENTARY-2-SMD-1101NE: Supplier 1: Digi-Key
U1 = STM32F103CBT6: as U3 on sheet Test_Jig_BMP2; DatasheetVersion: Rev. 16; PackageVersion: Rev. 6, 06/2013; PackageReference: LQFP48; PackageDescription: 48-Pin Low Profile Quad Flat Package, 7 x 7 mm Body, 0.5 mm Pitch; Supplier 1: Digi-Key; Supplier Part Number 1: 497-6288-ND; Supplier 2: Farnell; Supplier Part Number 2: 1606327; Supplier 3: Newark; Supplier Part Number 3: 11N8296; Supplier 4: Newark; Supplier Part Number 4: 57P1214; Supplier 5: Mouser; Supplier Part Number 5: 511-STM32F103CBT6; Core: ARM Cortex-M3; Packing: Tray; Mounting Technology: Surface Mount; PartNumber: STM32F103CBT6; ComponentLink1Description: Manufacturer URL; ComponentLink1URL: http://www.st.com/web/en/home.html; ComponentLink2Description: Datasheet; ComponentLink2URL: http://www.st.com/st-web-ui/static/active/en/resource/technical/document/datasheet/CD00161566.pdf; ComponentLink3Description: Package Specification; ComponentLink3URL: http://www.st.com/st-web-ui/static/active/en/resource/technical/document/datasheet/DM00058181.pdf
U2 = NUF2042XV6: as U4 on sheet Test_Jig_BMP2; Supplier 1: Digi-Key
Y1 = RESONATORSMD: Supplier 1: Digi-Key

## Nets that join several sheets
GND: Test_Jig_PPM-Encoder (13 pins), Test_Jig_BMP2 (22 pins), Test_Jig_Pixhawk_DUT (48 pins), Test_Jig_USB (34 pins), Test_Jig_BMP1 (22 pins)
FMU-SWCLK: Test_Jig_Pixhawk_DUT (P500.3), Test_Jig_BMP1 (U1.15)
FMU-SWDIO: Test_Jig_Pixhawk_DUT (P500.1), Test_Jig_BMP1 (U1.14)
IO-CH1-PROT: Test_Jig_PPM-Encoder (U5.30), Test_Jig_Pixhawk_DUT (P500.80)
IO-CH2-PROT: Test_Jig_PPM-Encoder (U5.31), Test_Jig_Pixhawk_DUT (P500.78)
IO-CH3-PROT: Test_Jig_PPM-Encoder (U5.32), Test_Jig_Pixhawk_DUT (P500.76)
IO-CH4-PROT: Test_Jig_PPM-Encoder (U5.1), Test_Jig_Pixhawk_DUT (P500.74)
IO-CH5-PROT: Test_Jig_PPM-Encoder (U5.2), Test_Jig_Pixhawk_DUT (P500.72)
IO-CH6-PROT: Test_Jig_PPM-Encoder (U5.9), Test_Jig_Pixhawk_DUT (P500.70)
IO-CH7-PROT: Test_Jig_PPM-Encoder (U5.10), Test_Jig_Pixhawk_DUT (P500.68)
IO-CH8-PROT: Test_Jig_PPM-Encoder (U5.11), Test_Jig_Pixhawk_DUT (P500.66)
IO-SWCLK: Test_Jig_BMP2 (U3.15), Test_Jig_Pixhawk_DUT (P500.71)
IO-SWDIO: Test_Jig_BMP2 (U3.14), Test_Jig_Pixhawk_DUT (P500.69)
IO-USART1_RX_SPECTRUM_DSM: Test_Jig_BMP2 (U3.30), Test_Jig_Pixhawk_DUT (P500.48)
IO-USART1_TX: Test_Jig_BMP2 (U3.31), Test_Jig_Pixhawk_DUT (P500.46)
PPM-SBUS-PROT: Test_Jig_PPM-Encoder (R3.1 U5.14), Test_Jig_Pixhawk_DUT (P500.62)
SERIAL5_RX: Test_Jig_Pixhawk_DUT (P500.12), Test_Jig_BMP1 (U1.30)
SERIAL5_TX: Test_Jig_Pixhawk_DUT (P500.14), Test_Jig_BMP1 (U1.31)
USB_1_N: Test_Jig_USB (IC1.1), Test_Jig_BMP1 (U2.4)
USB_1_P: Test_Jig_USB (IC1.2), Test_Jig_BMP1 (R40.P$2 U2.6)
USB_2_N: Test_Jig_BMP2 (U4.4), Test_Jig_USB (IC1.3)
USB_2_P: Test_Jig_BMP2 (R41.P$2 U4.6), Test_Jig_USB (IC1.4)
USB_3_N: Test_Jig_Pixhawk_DUT (P500.33), Test_Jig_USB (IC1.6)
USB_3_P: Test_Jig_Pixhawk_DUT (P500.31), Test_Jig_USB (IC1.7)
USB_4_N: Test_Jig_Pixhawk_DUT (P501.33), Test_Jig_USB (IC1.8)
USB_4_P: Test_Jig_Pixhawk_DUT (P501.31), Test_Jig_USB (IC1.9)
VBUS: Test_Jig_Pixhawk_DUT (13 pins), Test_Jig_USB (5 pins)
VDD33: Test_Jig_PPM-Encoder (8 pins), Test_Jig_BMP2 (15 pins), Test_Jig_Pixhawk_DUT (7 pins), Test_Jig_USB (20 pins), Test_Jig_BMP1 (15 pins)
VDD_5V_HIPOWER: Test_Jig_BMP2 (R22.P$1 U4.5), Test_Jig_Pixhawk_DUT (PSM200.5V_HIPOWER), Test_Jig_BMP1 (R11.P$1 U2.5)
VDD_5V_PERIPH: Test_Jig_BMP2 (R17.P$1), Test_Jig_Pixhawk_DUT (L103.P$1 L105.P$1 L106.P$1 PSM200.5V_PERIPH), Test_Jig_BMP1 (R6.P$1)

## Assembly variants
Pixhawk_Jig: not fitted GND JP400 JP401 M3_MOUNT901 M3_MOUNT902 M3_MOUNT903 M3_MOUNT904 M3_MOUNT911 M3_MOUNT912 M3_MOUNT913 M3_MOUNT914 MISO MOSI RST SCK VDD33